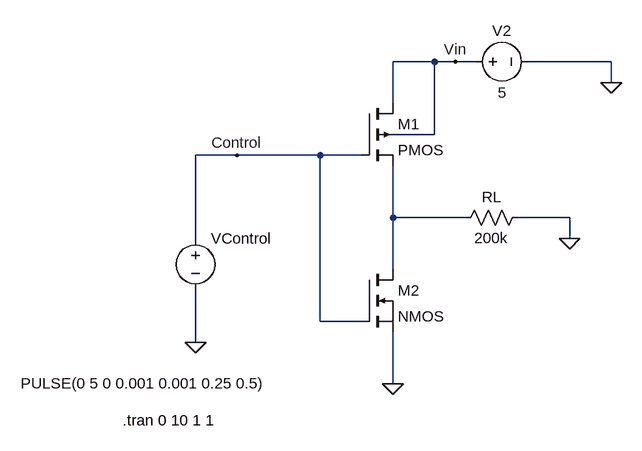
[diagram p0: schematic Project2Sw1.asc]
Project2Sw1.asc, the LTspice schematic file:
Version 4
SHEET 1 888 680
WIRE 480 -48 416 -48
WIRE 512 -48 480 -48
WIRE 544 -48 512 -48
WIRE 752 -48 624 -48
WIRE 752 -16 752 -48
WIRE 416 16 416 -48
WIRE 480 64 480 -48
WIRE 480 64 416 64
WIRE 176 96 112 96
WIRE 304 96 176 96
WIRE 368 96 304 96
WIRE 416 192 416 112
WIRE 528 192 416 192
WIRE 688 192 608 192
WIRE 112 224 112 96
WIRE 688 224 688 192
WIRE 416 272 416 192
WIRE 304 352 304 96
WIRE 368 352 304 352
WIRE 112 384 112 304
WIRE 416 448 416 368
FLAG 752 -16 0
FLAG 688 224 0
FLAG 112 384 0
FLAG 512 -48 Vin
FLAG 176 96 Control
FLAG 416 448 0
SYMBOL voltage 112 208 R0
WINDOW 3 -269 239 Left 2
WINDOW 123 0 0 Left 0
WINDOW 39 0 0 Left 0
SYMATTR InstName VControl
SYMATTR Value PULSE(0 5 0 0.001 0.001 0.25 0.5)
SYMBOL voltage 528 -48 R270
WINDOW 0 32 56 VTop 2
WINDOW 3 -32 56 VBottom 2
SYMATTR InstName V2
SYMATTR Value 5
SYMBOL pmos4 368 16 R0
SYMATTR InstName M1
SYMBOL nmos 368 272 R0
SYMATTR InstName M2
SYMBOL res 512 208 R270
WINDOW 0 32 56 VTop 2
WINDOW 3 0 56 VBottom 2
SYMATTR InstName RL
SYMATTR Value 200k
TEXT 0 504 Left 2 !.tran 0 10 1 1

The netlist it stands for:
* Project2Sw1.asc
VControl Control 0 PULSE(0 5 0 0.001 0.001 0.25 0.5)
V2 Vin 0 5
M1 Vin Control N001 Vin PMOS
M2 N001 Control 0 0 NMOS
RL N001 0 200k
.model NMOS NMOS
.model PMOS PMOS
.lib standard.mos
.tran 0 10 1 1
.backanno
.end